# Altium schematic sheet MCU.SchDoc
size A; SheetNumber: 1
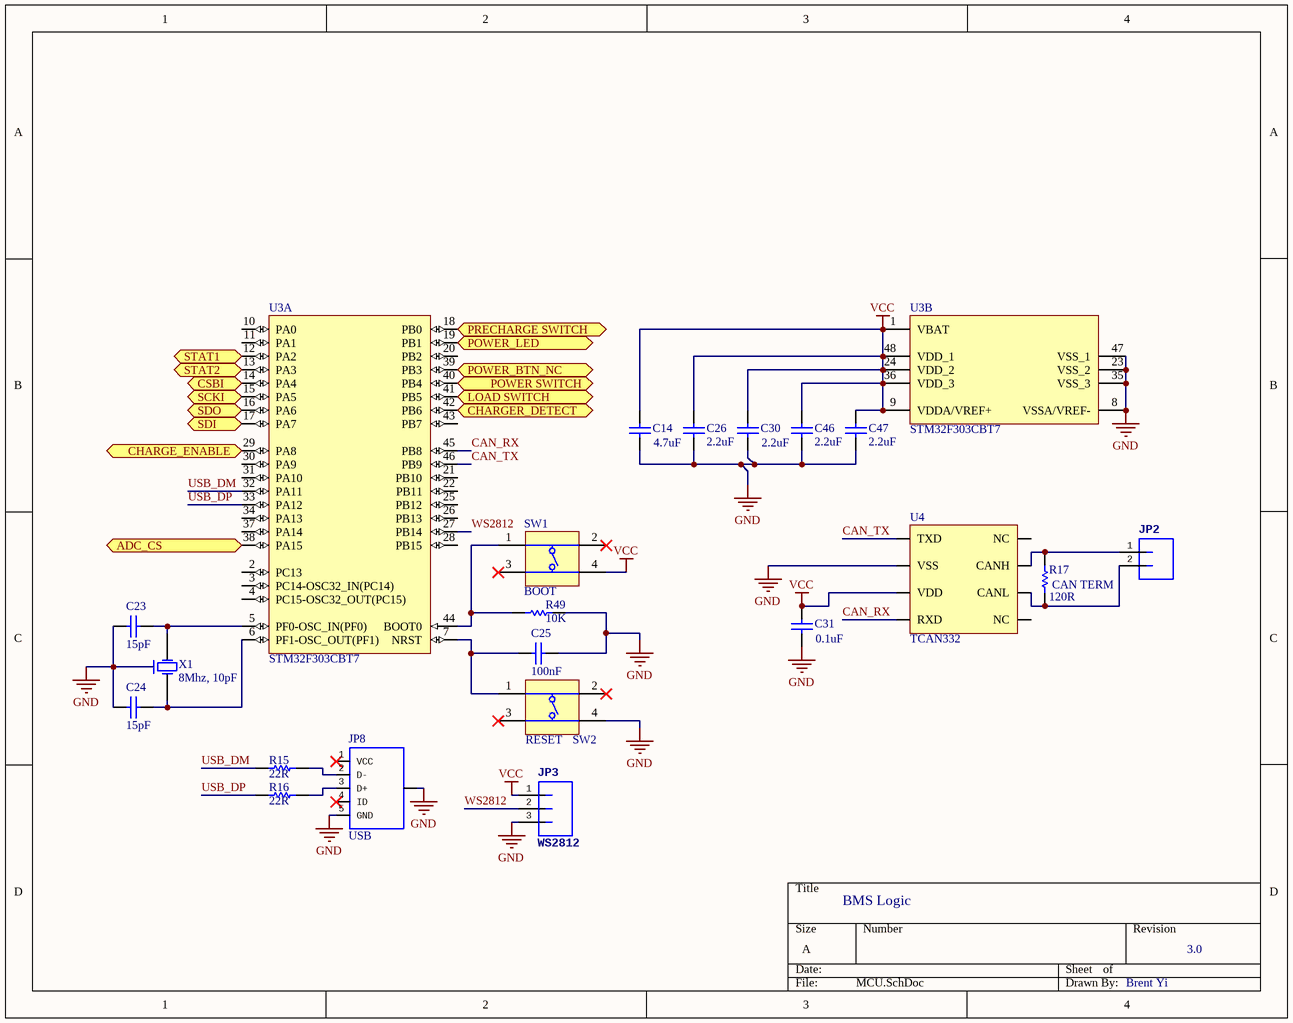
[diagram p0: MCU.SchDoc]

## Parts
C14  4.7uF  [CAPC0603(1608)55_N]
C23  value 15pF  [CAPC0603(1608)55_N]
C24  value 15pF  [CAPC0603(1608)55_N]
C25  value 100nF  [CAPC0603(1608)55_N]
C26  2.2uF  [CAPC0603(1608)55_N]
C30  2.2uF  [CAPC0603(1608)55_N]
C31  value 0.1uF  [CAPC0603(1608)55_N]
C46  2.2uF  [CAPC0603(1608)55_N]
C47  2.2uF  [CAPC0603(1608)55_N]
JP2  (no value)  [JST-2-PTH-VERT]
JP3  WS2812  [JST-3-PTH-VERT]
JP8  USB  [USB-MICROB]
R15  value 22R  [RESC0603(1608)_N]
R16  value 22R  [RESC0603(1608)_N]
R17  CAN TERM  value 120R  [RESC0603(1608)_N]
R49  value 10K  [RESC0603(1608)_N]
SW1  BOOT  [SWITCH]
SW2  RESET  [SWITCH]
U3  STM32F303CBT7  [STM-LQFP48_L]  (parts A,B of 2)
U4  TCAN332  [SOT65P280X145-6N]
X1  8Mhz, 10pF  [ABRA-ABM3B-4_V]

## Ports
ADC_CS (out), CHARGE_ENABLE (out), CHARGER_DETECT (in), CSBI (out), LOAD SWITCH (out), POWER SWITCH, POWER_BTN_NC (in), POWER_LED, PRECHARGE SWITCH (out), SCKI (out), SDI (out), SDO (in), STAT1 (in), STAT2 (in)

## Nets
GND: C14.1 C23.2 C24.2 C25.1 C26.1 C30.1 C31.1 C46.1 C47.1 JP3.3 JP8.5(GND) JP8.6(SHIELD) R49.2 SW2.4(T3) U3.8(VSSA/VREF-) U3.23(VSS_2) U3.35(VSS_3) U3.47(VSS_1) U4.2(VSS) X1.2
VCC: C14.2 C26.2 C30.2 C31.2 C46.2 C47.2 JP3.1 SW1.4(T3) U3.1(VBAT) U3.9(VDDA/VREF+) U3.24(VDD_2) U3.36(VDD_3) U3.48(VDD_1) U4.3(VDD)
ADC_CS: U3.38(PA15) ; port ADC_CS
CAN_RX: U3.45(PB8) U4.4(RXD)
CAN_TX: U3.46(PB9) U4.1(TXD)
CHARGE_ENABLE: U3.29(PA8) ; port CHARGE_ENABLE
CHARGER_DETECT: U3.42(PB6) ; port CHARGER_DETECT
CSBI: U3.14(PA4) ; port CSBI
LOAD SWITCH: U3.41(PB5) ; port LOAD SWITCH
POWER SWITCH: U3.40(PB4) ; port POWER SWITCH
POWER_BTN_NC: U3.39(PB3) ; port POWER_BTN_NC
POWER_LED: U3.19(PB1) ; port POWER_LED
PRECHARGE SWITCH: U3.18(PB0) ; port PRECHARGE SWITCH
SCKI: U3.15(PA5) ; port SCKI
SDI: U3.17(PA7) ; port SDI
SDO: U3.16(PA6) ; port SDO
STAT1: U3.12(PA2) ; port STAT1
STAT2: U3.13(PA3) ; port STAT2
USB_DM: R15.1 U3.32(PA11)
USB_DP: R16.1 U3.33(PA12)
WS2812: JP3.2 U3.27(PB14)
NetC23_1: C23.1 U3.5(PF0-OSC_IN(PF0)) X1.1(X1)
NetC24_1: C24.1 U3.6(PF1-OSC_OUT(PF1)) X1.3(X2)
NetC25_2: C25.2 SW2.1(T1) U3.7(NRST)
NetJP2_1: JP2.1 R17.2 U4.7(CANH)
NetJP2_2: JP2.2 R17.1 U4.6(CANL)
NetJP8_2: JP8.2(D-) R15.2
NetJP8_3: JP8.3(D+) R16.2
NetR49_1: R49.1 SW1.1(T1) U3.44(BOOT0)

Not connected (* = marked no-connect by the designer): JP8 1(VCC)* 4(ID)*; SW1 2(T2)* 3(T3)*; SW2 2(T2)* 3(T3)*; U3 2(PC13) 3(PC14-OSC32_IN(PC14)) 4(PC15-OSC32_OUT(PC15)) 10(PA0) 11(PA1) 20(PB2) 21(PB10) 22(PB11) 25(PB12) 26(PB13) 28(PB15) 30(PA9) 31(PA10) 34(PA13) 37(PA14) 43(PB7); U4 5(NC) 8(NC)

## Notes on the sheet
- BMS Logic
- 3.0
- Brent Yi

## Library data of the parts
C14 C23-C26 C30 C31 C46 C47 = CMP-1035-02762-1: CAP 2.2uF 16V Â±10% 0603 (1608 Metric) Thickness 0.55mm SMD; Case-EIA: 0603; Case-Metric: 1608; Max Thickness: 0.55 mm; Technology: SMT; Rated Voltage: 16 V; Tolerance: Â±10%
  C14: Value: 4.7uF
  C26 C30 C46 C47: Value: 2.2uF
JP2 = JST_2_VERT
JP3 = JST_3
JP8 = USB_MICROB_PLUG-SMT: pin to pad: 1>VBUS 2>D- 3>D+ 4>ID 5>GND 6>MT1+P$1+P$2+MT2; PROD_ID: CONN-09900
R15-R17 R49 = CMP-1012-00050-1: 100R 0.1W 5% 0603 (1608 Metric)  SMD; Case-EIA: 0603; Case-Metric: 1608; Tolerance: 5 %; Technology: SMT; Power: 0.1 W
SW1 SW2 = DIPT-DTSM-6: Switch, SPNO Push Button SMD; Manufacturer: Diptronics; PartNumber: DTSM-61NT/R; Packing Type: Tape&Reel; Mechanical Life: 200,000 cycles; ComponentLink2URL: http://www.dip.com.tw/Products_tact.htm; ComponentLink1URL: http://www.dip.com.tw/; ComponentLink3URL: http://www.dip.com.tw/PDF/pro_tact/DTSM_G_-6_2_-V.pdf; PackageDescription: Switch, Through-Hole, 4 Leads, Body 8.5x8.5mm, Row Spacing 9.0mm, Pitch 4.5mm; ComponentLink2Description: Datasheet; ComponentLink3Description: Package Specification; ComponentLink1Description: Manufacturer URL; PackageReference: DTSM-6; Mounting Technology: Through Hole
U3 = CMP-0572-00018-2: ARM Cortex-M4 32-bit MCU, 128 KB Flash, 32 KB Internal RAM, 37 I/Os, 48-pin LQFP, -40 to 105 degC, Tray; Internal RAM Size (kB): 32; Operating Frequency(F) (Processor speed) (MHz): 72; FLASH Size (Prog) (kB): 128; D/A Converter: 2x12-bit (2 Channel); Supply Voltage(Vcc) min (V): 2; I/Os (High Current): 37; PackageReference: LQFP48; Mounting Technology: Surface Mount; PartNumber: STM32F303CBT7; ComponentLink3Description: Package Specification; ComponentLink1Description: Manufacturer URL; ComponentLink1URL: http://www.st.com/web/en/home.html; Packing: Tray; ComponentLink2URL: http://www.st.com/st-web-ui/static/active/en/resource/technical/document/datasheet/DM00058181.pdf; ComponentLink2Description: Datasheet; ComponentLink3URL: http://www.st.com/st-web-ui/static/active/en/resource/technical/document/datasheet/DM00058181.pdf; DatasheetVersion: Rev. 6; PackageDescription: 48-Pin Low Profile Quad Flat Package, 7 x 7 mm Body, 0.5 mm Pitch; PackageVersion: Rev. 6, 06/2013; Core: ARM Cortex-M4; PartId: 1
X1 = ABRA-ABM3B-4